# EAGLE design testing (EAGLE 6.4)
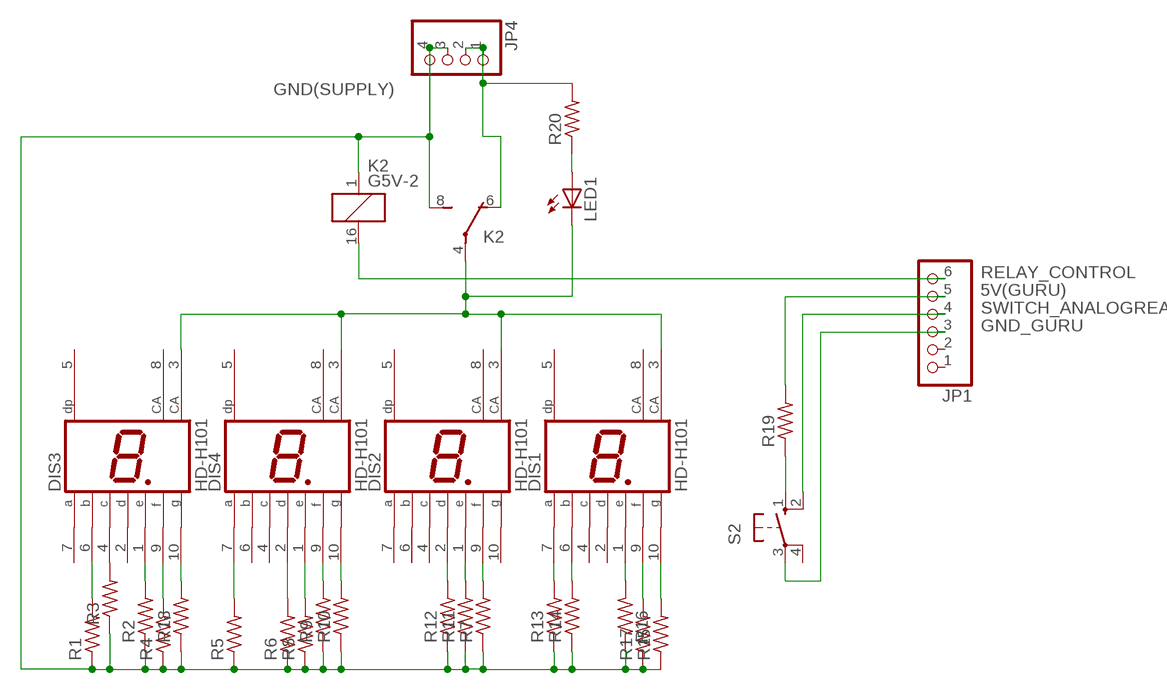
[diagram p0: schematic, sheet 1]

## Parts
DIS1  HD-H101  [HDSP-M]
DIS2  HD-H101  [HDSP-M]
DIS3  HD-H101  [HDSP-M]
DIS4  HD-H101  [HDSP-M]
JP1  PINHD-1X6/90  [1X06/90]
JP4  PINHD-1X4  [1X04]
K2  G5V-2  [G5V-2]
LED1  LED5MM  [LED5MM]
R1  RESISTOR0207/10  [0207/10]
R2  RESISTOR0207/10  [0207/10]
R3  RESISTOR0207/10  [0207/10]
R4  RESISTOR0207/10  [0207/10]
R5  RESISTOR0207/10  [0207/10]
R6  RESISTOR0207/10  [0207/10]
R7  RESISTOR0207/10  [0207/10]
R8  RESISTOR0207/10  [0207/10]
R9  RESISTOR0207/10  [0207/10]
R10  RESISTOR0207/10  [0207/10]
R11  RESISTOR0207/10  [0207/10]
R12  RESISTOR0207/10  [0207/10]
R13  RESISTOR0207/10  [0207/10]
R14  RESISTOR0207/10  [0207/10]
R15  RESISTOR0207/10  [0207/10]
R16  RESISTOR0207/10  [0207/10]
R17  RESISTOR0207/10  [0207/10]
R18  RESISTOR0207/10  [0207/10]
R19  RESISTOR0207/10  [0207/10]
R20  RESISTOR0207/10  [0207/10]
S2  10-XX  [B3F-10XX]

## Nets
5V(GURU): JP1.5 R19.2
5V(SUPPLY): JP4.1 JP4.2 K2.6(1:O) R20.2
GND(SUPPLY): JP4.3 JP4.4 K2.1 K2.8(1:S) R1.1 R2.1 R3.1 R4.1 R5.1 R6.1 R7.1 R8.1 R9.1 R10.1 R11.1 R12.1 R13.1 R14.1 R15.1 R16.1 R17.1 R18.1
GND_GURU: JP1.3 S2.3(P)
N$1: DIS1.3(CA) DIS2.3(CA) DIS3.3(CA) DIS4.3(CA) K2.4(1:P) LED1.K(C)
N$2: R19.1 S2.1(S)
N$3: LED1.A R20.1
N$4: DIS4.7(A) R5.2
N$5: DIS4.2(D) R6.2
N$6: DIS4.1(E) R8.2
N$7: DIS3.6(B) R1.2
N$8: DIS3.1(E) R2.2
N$9: DIS3.4(C) R3.2
N$10: DIS3.9(F) R4.2
N$11: DIS3.10(G) R18.2
N$12: DIS4.9(F) R9.2
N$13: DIS4.10(G) R10.2
N$14: DIS2.2(D) R12.2
N$15: DIS2.1(E) R11.2
N$16: DIS2.9(F) R7.2
N$17: DIS1.7(A) R13.2
N$18: DIS1.6(B) R14.2
N$19: DIS1.10(G) R15.2
N$20: DIS1.9(F) R17.2
N$21: DIS1.1(E) R16.2
RELAY_CONTROL: JP1.6 K2.16
SWITCH_ANALOGREAD: JP1.4 S2.2(S1)
Unconnected: DIS1.2(D) DIS1.4(C) DIS1.5(DP) DIS1.8(CA) DIS2.4(C) DIS2.5(DP) DIS2.6(B) DIS2.7(A) DIS2.8(CA) DIS2.10(G) DIS3.2(D) DIS3.5(DP) DIS3.7(A) DIS3.8(CA) DIS4.4(C) DIS4.5(DP) DIS4.6(B) DIS4.8(CA) JP1.1 JP1.2 K2.9(2:S) K2.11(2:O) K2.13(2:P) S2.4(P1)

## Library data of the parts
DIS1-DIS4 = display-hp:HD-H101: LED DISPLAY 1-character 7 segment, decimal point right; OC_FARNELL: unknown; OC_NEWARK: unknown
JP1 = pinhead:PINHD-1X6: PIN HEADER
JP4 = pinhead:PINHD-1X4: PIN HEADER
K2 = relay:G5V-2: OMRON PCB Relay Source: http://www.omron.com/ecb/products/pdf/en-g5v2.pdf; MPN: G5V-2 5DC; OC_FARNELL: 9949488; OC_NEWARK: 78K5703
LED1 = led:LED: LED OSRAM: - CHIPLED LG R971, LG N971, LY N971, LG Q971, LY Q971, LO R971, LY R971 LH N974, LH R974 LS Q976, LO Q976, LY Q976 LO Q996 - Hyper CHIPLED LW Q18S LB Q993, LB Q99A, LB R99A - SideLED LS A670, LO A670, LY A670, LG A670, LP A670 LB A673, LV A673, LT A673, LW A673 LH A674 LY A675 LS A676, LA A676, LO A676, LY A676, LW A676 LS A679, LY A679, LG A679 - Hyper Micro SIDELED® LS Y876, LA Y876, LO Y876, LY Y876 LT Y87S - SmartLED LW L88C, LW L88S LB L89C, LB L89S, LG L890 LS L89K, LO L89K, LY L89K LS L896, LA L896, LO L896, LY L896 - TOPLED LS T670, LO T670, LY T670, LG T670, LP T670 LSG T670, LSP T670, LSY T670, LOP T670, LYG T670 LG T671, LOG T671, LSG T671 LB T673, LV T673, LT T673, LW T673 LH T674 LS T676, LA T676, LO T676, LY T676, LB T676, LH T676, LSB T676, LW T676 LB T67C, LV T67C, LT T67C, LS T67K, LO T67K, LY T67K, LW E67C LS E67B, LA E67B, LO E67B, LY E67B, LB E67C, LV E67C, LT E67C LW T67C LS T679, LY T679, LG T679 LS T770, LO T770, LY T770, LG T770, LP T770 LB T773, LV T773, LT T773, LW T773 LH T774 LS E675, LA E675, LY E675, LS T675 LS T776, LA T776, LO T776, LY T776, LB T776 LHGB T686 LT T68C, LB T68C - Hyper Mini TOPLED® LB M676 - Mini TOPLED Santana® LG M470 LS M47K, LO M47K, LY M47K Source: http://www.osram.convergy.de LUXEON: - LUMILED® LXK2-PW12-R00, LXK2-PW12-S00, LXK2-PW14-U00, LXK2-PW14-V00 LXK2-PM12-R00, LXK2-PM12-S00, LXK2-PM14-U00 LXK2-PE12-Q00, LXK2-PE12-R00, LXK2-PE12-S00, LXK2-PE14-T00, LXK2-PE14-U00 LXK2-PB12-K00, LXK2-PB12-L00, LXK2-PB12-M00, LXK2-PB14-N00, LXK2-PB14-P00, LXK2-PB14-Q00 LXK2-PR12-L00, LXK2-PR12-M00, LXK2-PR14-Q00, LXK2-PR14-R00 LXK2-PD12-Q00, LXK2-PD12-R00, LXK2-PD12-S00 LXK2-PH12-R00, LXK2-PH12-S00 LXK2-PL12-P00, LXK2-PL12-Q00, LXK2-PL12-R00 Source: www.luxeon.com KINGBRIGHT: KA-3528ASYC Source: www.kingbright.com
R1-R20 = CEDTv68:RESISTOR
S2 = CEDTv68:10-XX: OMRON SWITCH

## Board
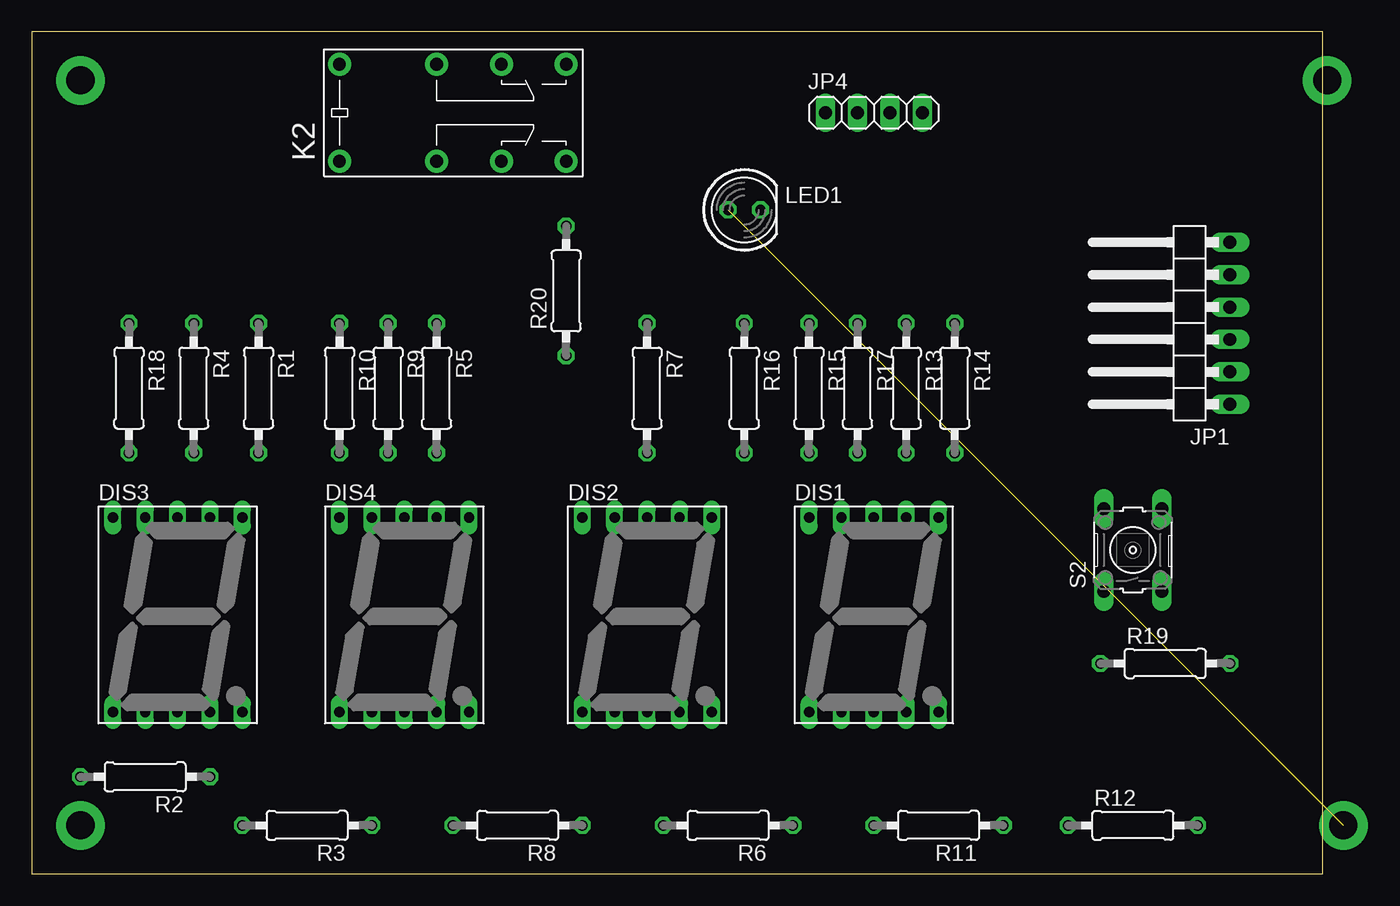
[diagram p1: board, top side]
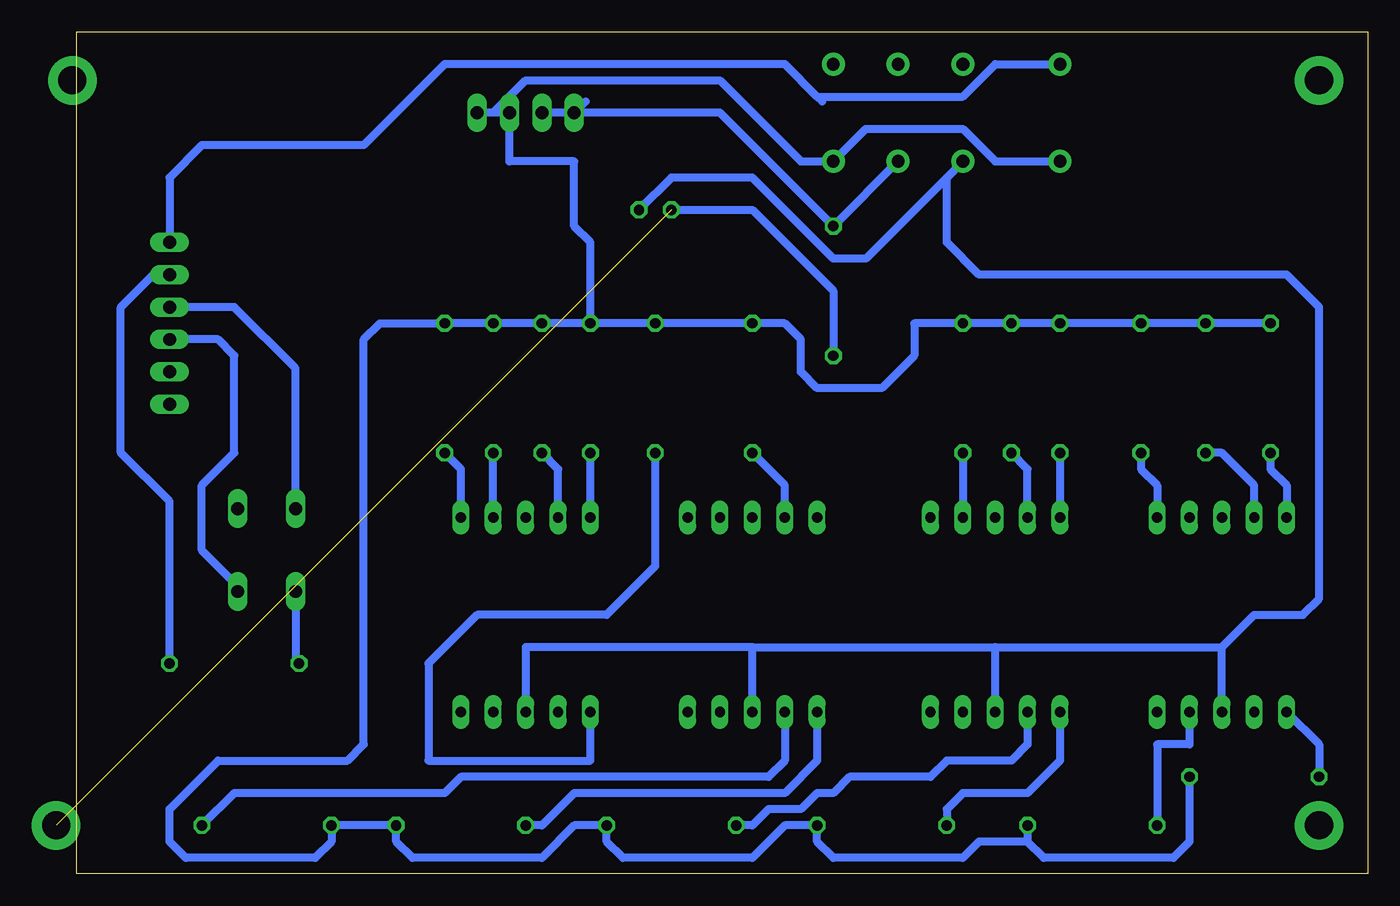
[diagram p2: board, bottom side, seen from below]

Size 101.27 x 66.03 mm. Coordinates in mm from the lower left corner, seen from the top.
Outline: 0,0 101.27,0 101.27,66.03 0,66.03 0,0
Copper layers (1*16): Top 0.035mm / dielectric 1.5mm / Bottom 0.035mm
Design rules "default *": minimum track width 24mil, minimum drill 24mil, track to track 16mil, track to pad 16mil, pad to pad 8mil, via to via 8mil, smd to smd 8mil, copper to edge 40mil, drill to drill 175mil, minimum pad ring 10mil, minimum via ring 8mil, stop-mask expansion 4mil, vias tented up to drill 0mil, thermal gap 10mil

### Footprints (pad centres in the part's own frame; a part is rotated, then mirrored left to right if it is on the bottom)
HDSP-M = drill 0.813 long: 1 -5.08,-7.62; 2 -2.54,-7.62; 3 0,-7.62; 4 2.54,-7.62; 5 5.08,-7.62; 6 5.08,7.62; 7 2.54,7.62; 8 0,7.62; 9 -2.54,7.62; 10 -5.08,7.62
1X06/90 = drill 1.016 long: 1 -6.35,-3.81; 2 -3.81,-3.81; 3 -1.27,-3.81; 4 1.27,-3.81; 5 3.81,-3.81; 6 6.35,-3.81
1X04 = drill 1.016 long: 1 -3.81,0; 2 -1.27,0; 3 1.27,0; 4 3.81,0
G5V-2 = drill 1 pad 1.8: 1 -8.89,-3.81; 4 -1.27,-3.81; 6 3.81,-3.81; 8 8.89,-3.81; 9 8.89,3.81; 11 3.81,3.81; 13 -1.27,3.81; 16 -8.89,3.81
LED5MM = drill 0.813 octagon: A -1.27,0; K 1.27,0
0207/10 = drill 0.813 octagon: 1 -5.08,0; 2 5.08,0
B3F-10XX = drill 1.016 long: 1 -3.251,2.261; 2 3.251,2.261; 3 -3.251,-2.261; 4 3.251,-2.261

### Placement (x,y rotation side)
DIS1  66.04,20.32 0 top
DIS2  48.26,20.32 0 top
DIS3  11.43,20.32 0 top
DIS4  29.21,20.32 0 top
JP1  90.17,43.18 90 top
JP4  66.04,59.69 0 top
K2  33.02,59.69 0 top
LED1  55.88,52.07 0 top
R1  17.78,38.1 270 top
R2  8.89,7.62 180 top
R3  21.59,3.81 180 top
R4  12.7,38.1 270 top
R5  31.75,38.1 270 top
R6  54.61,3.81 180 top
R7  48.26,38.1 270 top
R8  38.1,3.81 180 top
R9  27.94,38.1 270 top
R10  24.13,38.1 270 top
R11  71.12,3.81 180 top
R12  86.36,3.81 0 top
R13  68.58,38.1 270 top
R14  72.39,38.1 270 top
R15  60.96,38.1 270 top
R16  55.88,38.1 270 top
R17  64.77,38.1 270 top
R18  7.62,38.1 270 top
R19  88.9,16.51 0 top
R20  41.91,45.72 90 top
S2  86.36,25.4 90 top

### Tracks (layer width: path | path; a pad name or v marks a point on that pad's centre or on a via)
5V(GURU)
  Bottom 0.61: R19.2 93.98,29.21 97.79,33.02 97.79,44.45 95.25,46.99 JP1.5
5V(SUPPLY)
  Bottom 0.61: 61.34,60.58 JP4.1 | JP4.1 JP4.2 | K2.6 R20.2 50.8,59.69 JP4.1
GND(SUPPLY)
  Bottom 0.61: 68.58,59.69 JP4.3 67.31,55.88 62.23,55.88 62.23,50.8 60.96,49.53 R15.1 | 68.58,59.69 JP4.4 | R18.1 R4.1 R1.1 R10.1 | R10.1 R9.1 R5.1 | R15.1 R16.1 R7.1 45.72,43.18 44.45,41.91 44.45,39.37 43.18,38.1 38.1,38.1 35.56,40.64 35.56,43.18 R5.1 | R15.1 R17.1 R13.1 R14.1 77.47,43.18 78.74,41.91 78.74,10.16 80.01,8.89 90.17,8.89 93.98,5.08 93.98,2.54 92.71,1.27 82.55,1.27 81.28,2.54 R12.1 R11.1 76.2,2.54 74.93,1.27 64.77,1.27 62.23,3.81 R6.1 59.69,2.54 58.42,1.27 48.26,1.27 45.72,3.81 R8.1 43.18,2.54 41.91,1.27 31.75,1.27 30.48,2.54 26.67,2.54 | R3.1 26.67,2.54 | 26.67,2.54 25.4,1.27 15.24,1.27 13.97,2.54 R2.1 | K2.1 29.21,55.88 31.75,58.42 39.37,58.42 K2.8 44.45,55.88 50.8,62.23 66.04,62.23 68.58,59.69 | R10.1 R5.1
GND_GURU
  Bottom 0.61: S2.3 88.62,22.58 91.44,25.4 91.44,30.48 88.9,33.02 88.9,40.64 90.17,41.91 JP1.3
N$1
  Bottom 0.61: DIS3.3 11.43,17.78 | 11.43,17.78 8.89,20.32 5.08,20.32 3.81,21.59 3.81,44.45 6.35,46.99 30.48,46.99 33.02,49.53 33.02,54.61 | DIS4.3 29.21,17.78 | 29.21,17.78 11.43,17.78 | 48.26,17.78 29.21,17.78 | DIS2.3 48.26,17.78 | 48.26,17.78 66.04,17.78 DIS1.3 | LED1.K 54.61,54.61 48.26,54.61 41.91,48.26 39.37,48.26 33.02,54.61 | 33.02,54.61 K2.4
N$2
  Bottom 0.61: S2.1 84.1,16.79 R19.1
N$3  (via drill 2.2 pad 3.81)  (1 unrouted)
  Bottom 0.61: R20.1 41.91,45.72 48.26,52.07 LED1.A
  other vias: 102.87,3.81
N$4
  Bottom 0.61: R5.2 DIS4.7
N$5
  Bottom 0.61: DIS4.2 26.67,10.16 27.94,8.89 33.02,8.89 34.29,7.62 40.64,7.62 41.91,6.35 43.18,6.35 44.45,5.08 46.99,5.08 48.26,3.81 R6.2
N$6
  Bottom 0.61: DIS4.1 24.13,8.89 26.67,6.35 31.75,6.35 33.02,5.08 R8.2
N$7
  Bottom 0.61: R1.2 17.78,31.75 16.51,30.48 DIS3.6
N$8
  Bottom 0.61: DIS3.1 3.81,10.16 R2.2
N$9
  Bottom 0.61: DIS3.4 13.97,10.16 16.51,10.16 R3.2
N$10
  Bottom 0.61: DIS3.9 8.89,30.48 11.43,33.02 R4.2
N$11
  Bottom 0.61: R18.2 7.62,31.75 6.35,30.48 DIS3.10
N$12
  Bottom 0.61: DIS4.9 26.67,31.75 R9.2
N$13
  Bottom 0.61: R10.2 DIS4.10
N$14
  Bottom 0.61: DIS2.2 45.72,8.89 46.99,7.62 71.12,7.62 72.39,6.35 88.9,6.35 R12.2
N$15
  Bottom 0.61: DIS2.1 43.18,8.89 45.72,6.35 62.23,6.35 64.77,3.81 R11.2
N$16
  Bottom 0.61: DIS2.9 45.72,30.48 R7.2
N$17
  Bottom 0.61: DIS1.7 R13.2
N$18
  Bottom 0.61: DIS1.6 71.12,31.75 R14.2
N$19
  Bottom 0.61: DIS1.10 R15.2
N$20
  Bottom 0.61: DIS1.9 63.5,31.75 R17.2
N$21
  Bottom 0.61: R16.2 55.88,24.13 59.69,20.32 69.85,20.32 73.66,16.51 73.66,8.89 60.96,8.89 DIS1.1
N$22  (via drill 2.2 pad 3.81)
  other vias: 101.6,62.23 101.6,62.23
N$23  (via drill 2.2 pad 3.81)
  other vias: 3.81,62.23
N$24  (via drill 2.2 pad 3.81)
  other vias: 3.81,3.81
RELAY_CONTROL
  Bottom 0.61: 42.8,60.58 43.18,60.96 | 43.18,60.96 45.72,63.5 72.39,63.5 78.74,57.15 91.44,57.15 93.98,54.61 JP1.6 | K2.16 29.21,63.5 31.75,60.96 43.18,60.96
SWITCH_ANALOGREAD
  Bottom 0.61: S2.2 84.1,39.65 88.9,44.45 JP1.4